# EAGLE schematic Wire_Puzzle (EAGLE 9.6.2)
AUTHOR: Adam Billingsley; VERSION: v1.0
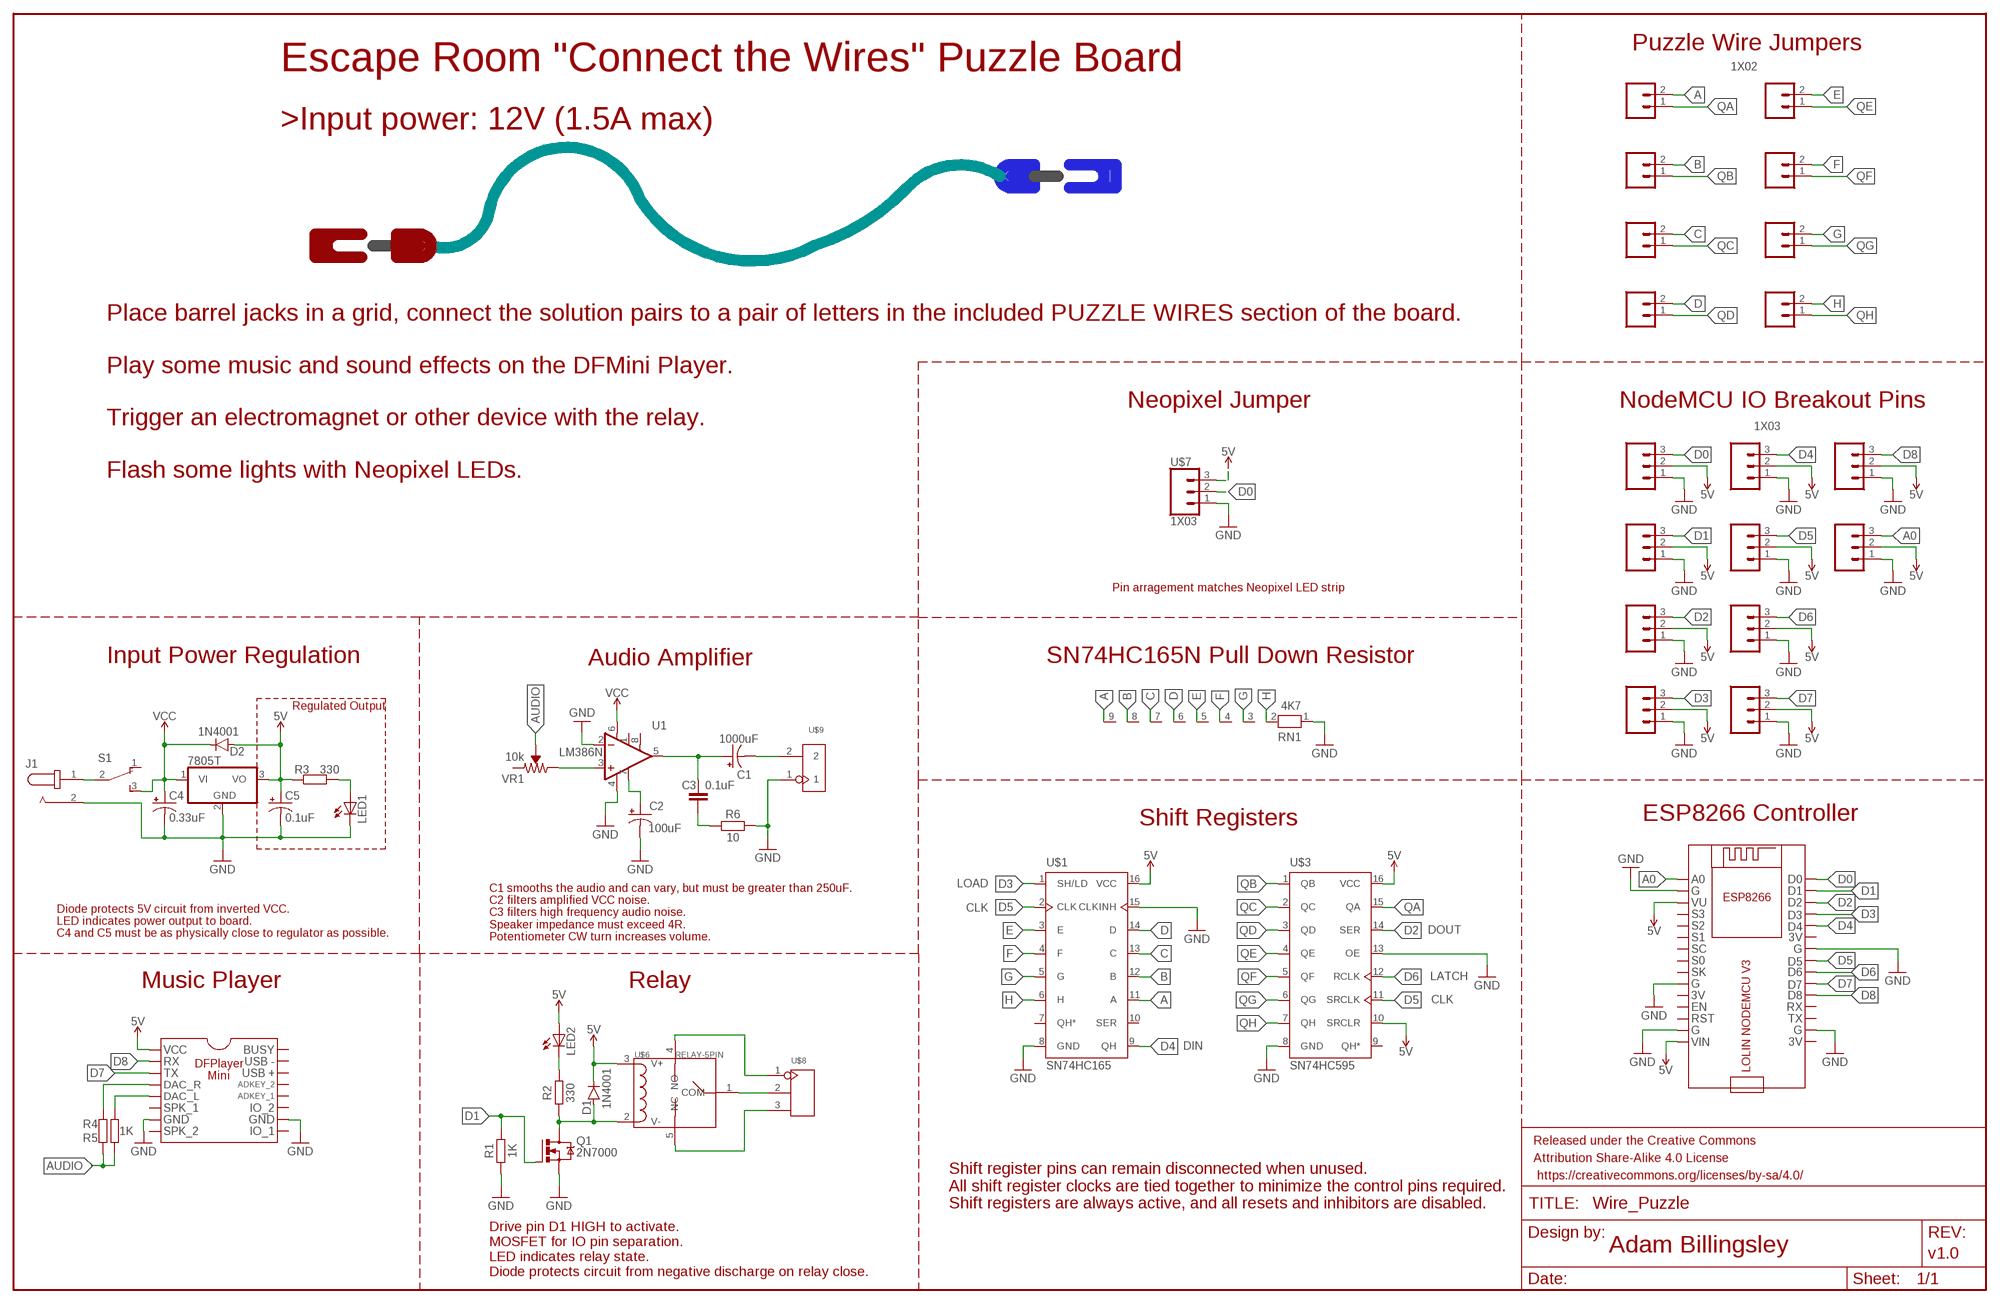
[diagram p0: schematic, sheet 1]

## Parts
C1  1000uF  CPOL-USE5-10.5  [E5-10,5]
C2  100uF  CPOL-USE5-10.5  [E5-10,5]
C3  0.1uF  C2.5/2  [C2.5-2]
C4  0.33uF  CPOL-USE2-5  [E2-5]
C5  0.1uF  CPOL-USE2-5  [E2-5]
D1  1N4001  1N4004  [DO-41]
D2  1N4001  1N4004  [DO-41]
FRAME1  FRAME-LEDGER  [CREATIVE_COMMONS]
IC1  7805T  [TO220H]
J1  POWER_JACK_PJ-037A  [CUI_PJ-037A]
LED1  LED5MM  [LED5MM]
LED2  LED5MM  [LED5MM]
Q1  2N7000  NMOSFET__TO92  [TO92]
R1  1K  R_AXIAL-7.2MM-PITCH  [RESAD724W46L381D178B]
R2  330  R_AXIAL-7.2MM-PITCH  [RESAD724W46L381D178B]
R3  330  R_AXIAL-7.2MM-PITCH  [RESAD724W46L381D178B]
R4  1K  R_AXIAL-7.2MM-PITCH  [RESAD724W46L381D178B]
R5  1K  R_AXIAL-7.2MM-PITCH  [RESAD724W46L381D178B]
R6  10  R_AXIAL-7.2MM-PITCH  [RESAD724W46L381D178B]
RN1  4K7  RN08  [RN-9]
S1  SWITCH_SLIDING_SSP1S1  [SWITCH_SLIDING_SSP1S1]
U1  LM386N  LM386  [DIP08]
U$1  SN74HC165  [DIL16]
U$3  SN74HC595  [DIL16]
U$4  LOLIN_NODEMCU  [LOLIN_NODEMCU]
U$5  DFPLAYER_MINI  [DFMINI]
U$6  RELAY-5PIN  [RELAY-19.0X15.0X15.0MM]
U$7  1X03  [1X03]
U$8  TERMINAL_BLOCK_3P  [H3-5.0-15.5X8.0MM]
U$9  TERMINAL_BLOCK_2P  [H2-5.0-10.5X8.0MM]
U$10  1X02  [1X02]
U$11  1X02  [1X02]
U$12  1X02  [1X02]
U$13  1X02  [1X02]
U$14  1X02  [1X02]
U$15  1X02  [1X02]
U$16  1X02  [1X02]
U$17  1X02  [1X02]
U$18  1X03  [1X03]
U$19  1X03  [1X03]
U$20  1X03  [1X03]
U$21  1X03  [1X03]
U$22  1X03  [1X03]
U$23  1X03  [1X03]
U$24  1X03  [1X03]
U$25  1X03  [1X03]
U$26  1X03  [1X03]
U$27  1X03  [1X03]
VR1  10k  TRIMPOT-PTH-10MM-KNOB-1/2W-10%  [TRIMPOT-PTH-3386U]

## Nets
5V: C5.+ D1.C D2.A IC1.3(VO) LED2.A R3.1 U$1.16(VCC) U$3.10(SRCLR) U$3.16(VCC) U$4.P$1(VIN) U$4.P$13(VU) U$5.P$9 U$6.3(V+) U$7.3 U$18.2 U$19.2 U$20.2 U$21.2 U$22.2 U$23.2 U$24.2 U$25.2 U$26.2 U$27.2
A: RN1.9 U$1.11(A) U$10.2
A0: U$4.P$15(A0) U$27.3
AUDIO: R4.1 R5.1 VR1.2(WIPER)
B: RN1.8 U$1.12(B) U$11.2
C: RN1.7 U$1.13(C) U$12.2
D: RN1.6 U$1.14(D) U$13.2
D0: U$4.P$31(D0) U$7.2 U$18.3
D1: Q1.2(G) R1.1 U$4.P$30(D1) U$19.3
D2: U$3.14(SER) U$4.P$29(D2) U$20.3
D3: U$1.1(SH/LD) U$4.P$28(D3) U$21.3
D4: U$1.9(QH) U$4.P$27(D4) U$22.3
D5: U$1.2(CLK) U$3.11(SRCLK) U$4.P$24(D5) U$23.3
D6: U$3.12(RCLK) U$4.P$23(D6) U$24.3
D7: U$4.P$22(D7) U$5.P$11 U$25.3
D8: U$4.P$21(D8) U$5.P$10 U$26.3
E: RN1.5 U$1.3(E) U$14.2
F: RN1.4 U$1.4(F) U$15.2
G: RN1.3 U$1.5(G) U$16.2
GND: C2.- C4.- C5.- IC1.2(GND) J1.2 LED1.K(C) Q1.3(S) R1.2 R6.2 RN1.1 U1.2(-IN) U1.4(V-) U$1.8(GND) U$1.15(CLKINH) U$3.8(GND) U$3.13(OE) U$4.P$2(G_1) U$4.P$6(G_2) U$4.P$14(G_3) U$4.P$18(G_4) U$4.P$25(G_5) U$5.P$7 U$5.P$15 U$7.1 U$9.1 U$18.1 U$19.1 U$20.1 U$21.1 U$22.1 U$23.1 U$24.1 U$25.1 U$26.1 U$27.1
H: RN1.2 U$1.6(H) U$17.2
N$1: U$6.1(COM) U$8.2
N$2: U$6.4(NO) U$8.1
N$3: U$6.5(NC) U$8.3
N$4: D1.A Q1.1(D) R2.1 U$6.2(V-)
N$5: LED1.A R3.2
N$6: LED2.K(C) R2.2
N$7: C1.+ C3.1 U1.5(OUT)
N$8: R4.2 U$5.P$12
N$9: C1.- U$9.2
N$10: C3.2 R6.1
N$11: R5.2 U$5.P$13
N$12: U1.3(+IN) VR1.3(CW)
N$13: J1.1 S1.2(P)
N$14: C2.+ U1.7(BP)
QA: U$3.15(QA) U$10.1
QB: U$3.1(QB) U$11.1
QC: U$3.2(QC) U$12.1
QD: U$3.3(QD) U$13.1
QE: U$3.4(QE) U$14.1
QF: U$3.5(QF) U$15.1
QG: U$3.6(QG) U$16.1
QH: U$3.7(QH) U$17.1
VCC: C4.+ D2.C IC1.1(VI) S1.3(S) U1.6(V+)
Unconnected: S1.1(O) U1.1(GAIN) U1.8(GAIN) U$1.7(QH*) U$1.10(SER) U$3.9(QH*) U$4.P$3(RST) U$4.P$4(EN) U$4.P$7(SK) U$4.P$8(S0) U$4.P$9(SC) U$4.P$10(S1) U$4.P$11(S2) U$4.P$12(S3) U$4.P$19(TX) U$4.P$20(RX) U$5.P$1 U$5.P$2 U$5.P$3 U$5.P$4 U$5.P$5 U$5.P$6 U$5.P$8 U$5.P$14 U$5.P$16 VR1.1(CCW)

## Notes on the sheet
- Puzzle Wire Jumpers
- Escape Room "Connect the Wires" Puzzle Board
- >Input power: 12V (1.5A max)
- Neopixel Jumper | NodeMCU IO Breakout Pins
- Place barrel jacks in a grid, connect the solution pairs to a pair of letters in the included PUZZLE WIRES section of the board.
  
  Play some music and sound effects on the DFMini Player.
  
  Trigger an electromagnet or other device with the relay.
  
  Flash some lights with Neopixel LEDs.
- Pin arragement matches Neopixel LED strip
- Input Power Regulation | Audio Amplifier | SN74HC165N Pull Down Resistor
- Regulated Output
- Shift Registers | ESP8266 Controller
- C1 smooths the audio and can vary, but must be greater than 250uF.
  C2 filters amplified VCC noise.
  C3 filters high frequency audio noise.
  Speaker impedance must exceed 4R.
  Potentiometer CW turn increases volume.
- LOAD
- Diode protects 5V circuit from inverted VCC.
  LED indicates power output to board.
  C4 and C5 must be as physically close to regulator as possible.
- CLK
- DOUT
- LATCH
- Music Player | Relay
- CLK
- DIN
- Shift register pins can remain disconnected when unused.
  All shift register clocks are tied together to minimize the control pins required.
  Shift registers are always active, and all resets and inhibitors are disabled.
- Drive pin D1 HIGH to activate.
  MOSFET for IO pin separation.
  LED indicates relay state.
  Diode protects circuit from negative discharge on relay close.

## Power pins joined to a net without a drawn wire
3V_1: U$4.P$5(3V_1)
3V_2: U$4.P$17(3V_2)
3V_3: U$4.P$26(3V_3)

## Library data of the parts
C1 C2 = adafruit:CPOL-US: POLARIZED CAPACITOR, American symbol
C3 = capacitor-wima:C: CAPACITOR naming: grid - package width
C4 C5 = rcl:CPOL-US: POLARIZED CAPACITOR, American symbol; SPICEPREFIX: C
D1 D2 = Diodes:1N4004: DIODE GEN PURP 400V 1A DO41 Manufacturer's datasheet <https://www.mccsemi.com/pdf/Products/1N4001-1N4007(DO-41).pdf>; CREATED_BY: PCBLayout.com; DIGIKEY_PART_NUMBER: 1N4004MSCT-ND; MANUFACTURER: Micro Commercial Co; MPN: 1N4004; PACKAGE: DO-41
FRAME1 = Adam's Parts (work):FRAME-LEDGER: Schematic Frame - Ledger Standard 11x14 US Ledger frame
IC1 = linear:78*: Positive VOLTAGE REGULATOR Source: http://cache.national.com/ds/LM/LM78L05.pdf http://www.fairchildsemi.com/ds/LM/LM7805.pdf
J1 = Adam's Parts (work):POWER_JACK_PJ-037A: 2.0 mm Center Pin, 2.5 A, Right Angle, Through Hole, Dc Power Jack Connector; MANUFACTURER: CUI INC; STANDARD: Manufacturer recommendations
LED1 LED2 = adafruit:LED: LED OSRAM: - CHIPLED LG R971, LG N971, LY N971, LG Q971, LY Q971, LO R971, LY R971 LH N974, LH R974 LS Q976, LO Q976, LY Q976 LO Q996 - Hyper CHIPLED LW Q18S LB Q993, LB Q99A, LB R99A - SideLED LS A670, LO A670, LY A670, LG A670, LP A670 LB A673, LV A673, LT A673, LW A673 LH A674 LY A675 LS A676, LA A676, LO A676, LY A676, LW A676 LS A679, LY A679, LG A679 - Hyper Micro SIDELED® LS Y876, LA Y876, LO Y876, LY Y876 LT Y87S - SmartLED LW L88C, LW L88S LB L89C, LB L89S, LG L890 LS L89K, LO L89K, LY L89K LS L896, LA L896, LO L896, LY L896 - TOPLED LS T670, LO T670, LY T670, LG T670, LP T670 LSG T670, LSP T670, LSY T670, LOP T670, LYG T670 LG T671, LOG T671, LSG T671 LB T673, LV T673, LT T673, LW T673 LH T674 LS T676, LA T676, LO T676, LY T676, LB T676, LH T676, LSB T676, LW T676 LB T67C, LV T67C, LT T67C, LS T67K, LO T67K, LY T67K, LW E67C LS E67B, LA E67B, LO E67B, LY E67B, LB E67C, LV E67C, LT E67C LW T67C LS T679, LY T679, LG T679 LS T770, LO T770, LY T770, LG T770, LP T770 LB T773, LV T773, LT T773, LW T773 LH T774 LS E675, LA E675, LY E675, LS T675 LS T776, LA T776, LO T776, LY T776, LB T776 LHGB T686 LT T68C, LB T68C - Hyper Mini TOPLED® LB M676 - Mini TOPLED Santana® LG M470 LS M47K, LO M47K, LY M47K Source: http://www.osram.convergy.de/
Q1 = Tinkercad:NMOSFET: N-Channel MOSFET - Generic; CATEGORY: Transistor; SUB-CATEGORY: MOSFET; TYPE: N-Channel; VALUE: NMOSFET
R1-R6 = Resistor:R: Resistor Fixed - Generic; CATEGORY: Resistor; SUB-CATEGORY: Fixed
RN1 = resistor-net:RN08: RESISTOR NETWORK; OC_FARNELL: unknown; OC_NEWARK: unknown
S1 = Adam's Parts (work):SWITCH_SLIDING_SSP1S1: SLIDING SWITCH Distributor Buerklin, 11G810
U1 = SparkFun-IC-Amplifiers:LM386: low voltage audio power amplifier SparkFun Products FabFM Radio Kit <https://www.sparkfun.com/products/11043> (KIT-11043); PROD_ID: IC-10899
U$1 = Adam's Parts (work):SN74HC165
U$3 = Adam's Parts (work):SN74HC595
U$4 = Adam's Parts (work):LOLIN_NODEMCU
U$5 = Adam's Parts (work):DFPLAYER_MINI
U$6 = Adam's Parts (work):RELAY-5PIN
U$7 U$18-U$27 = Adam's Parts (work):1X03
U$8 = Adam's Parts (work):TERMINAL_BLOCK_3P
U$9 = Adam's Parts (work):TERMINAL_BLOCK_2P
U$10-U$17 = Adam's Parts (work):1X02
VR1 = SparkFun-Resistors:TRIMPOT: Trimming Potentiometer (Trimpot) Three-terminal potentiometers, with an adjustable wiper and two adjustable resistors. A pot can be used to create a configurable voltage divider, or as a variable resistor. "Trimpots" are a subset of potentiometers, usually intended for "set-and-forget" applications. They're often more delicate than standard potentiometers - rated for fewer turns. Variants PTH-KNOB - PTH Trimpot w/ finger-adjustable knob Trimpot 10K with Knob <https://www.sparkfun.com/products/9806> (COM-09806) Datasheet <http://www.sparkfun.com/datasheets/Components/General/TSR-3386.pdf> SMD-3MM-CLOSED-FRAME - SMD 3mm Square Closed-Frame Trimpot Used on e.g. EasyDriver - Stepper Motor Driver <https://www.sparkfun.com/products/12779> Datasheet <http://www.bitechnologies.com/pdfs/22.pdf> (22AR10KTR) SMD-5MM - SMD 5mm Square Closed-Frame Trimpot Used on e.g. IOIO-OTG - V2.2 <https://www.sparkfun.com/products/13613> Datasheet <http://www.vishay.com/docs/51008/ts53.pdf> (TS53YL502MR10) SMD-3MM-1/10W-25% - 3mm Square Open-Frame Trimpot Used on e.g. SparkFun Shapeoko <https://www.sparkfun.com/products/13899> Datasheet <http://www.bourns.com/docs/Product-Datasheets/TC33.pdf> (TC33X-2-103E); PROD_ID: RES-09730; SF_SKU: COM-09806